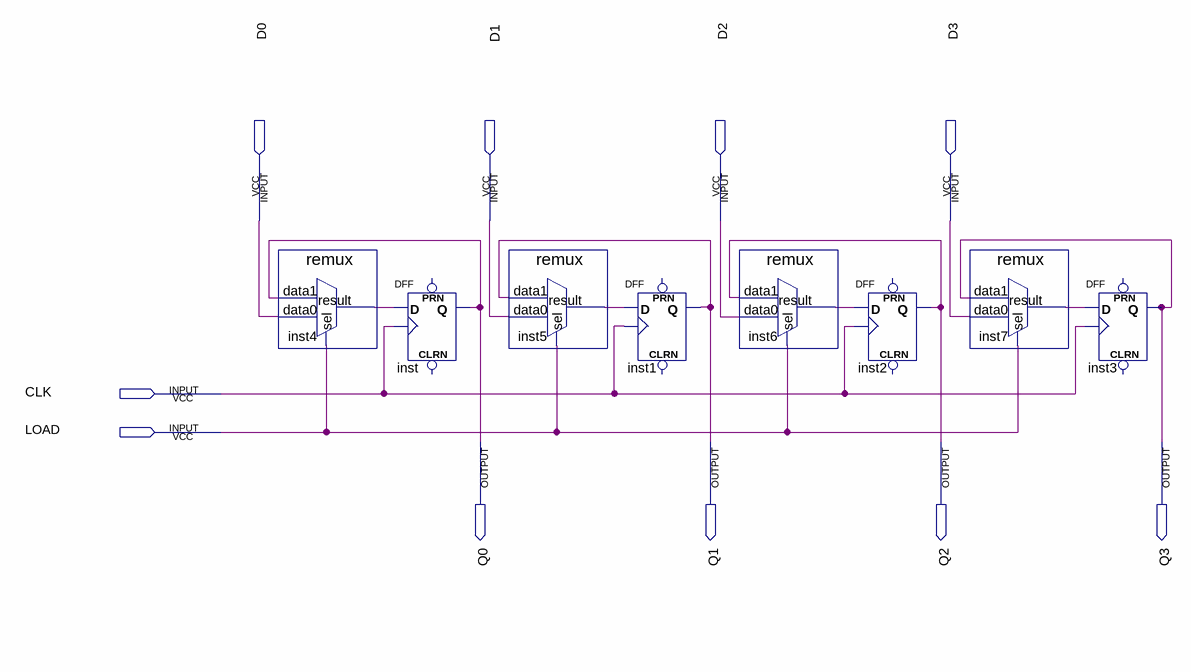
[diagram p0: schematic sheet]
// Quartus schematic reg4bit.bdf as structural Verilog: 8 symbols, 10 pins
module reg4bit (
  input  D0,
  input  D1,
  input  D2,
  input  D3,
  input  CLK,
  input  LOAD,
  output Q0,
  output Q1,
  output Q2,
  output Q3
);

  wire inst4_result, inst5_result, inst6_result, inst7_result;

  remux inst4 (.data1(Q0), .data0(D0), .sel(LOAD), .result(inst4_result));
  DFF inst (.CLK(CLK), .D(inst4_result), .Q(Q0));  // open: CLRN, PRN
  remux inst5 (.data1(Q1), .data0(D1), .sel(LOAD), .result(inst5_result));
  DFF inst1 (.CLK(CLK), .D(inst5_result), .Q(Q1));  // open: CLRN, PRN
  remux inst6 (.data1(Q2), .data0(D2), .sel(LOAD), .result(inst6_result));
  DFF inst2 (.CLK(CLK), .D(inst6_result), .Q(Q2));  // open: CLRN, PRN
  remux inst7 (.data1(Q3), .data0(D3), .sel(LOAD), .result(inst7_result));
  DFF inst3 (.CLK(CLK), .D(inst7_result), .Q(Q3));  // open: CLRN, PRN
endmodule
